# EAGLE design controller (EAGLE 6.4)
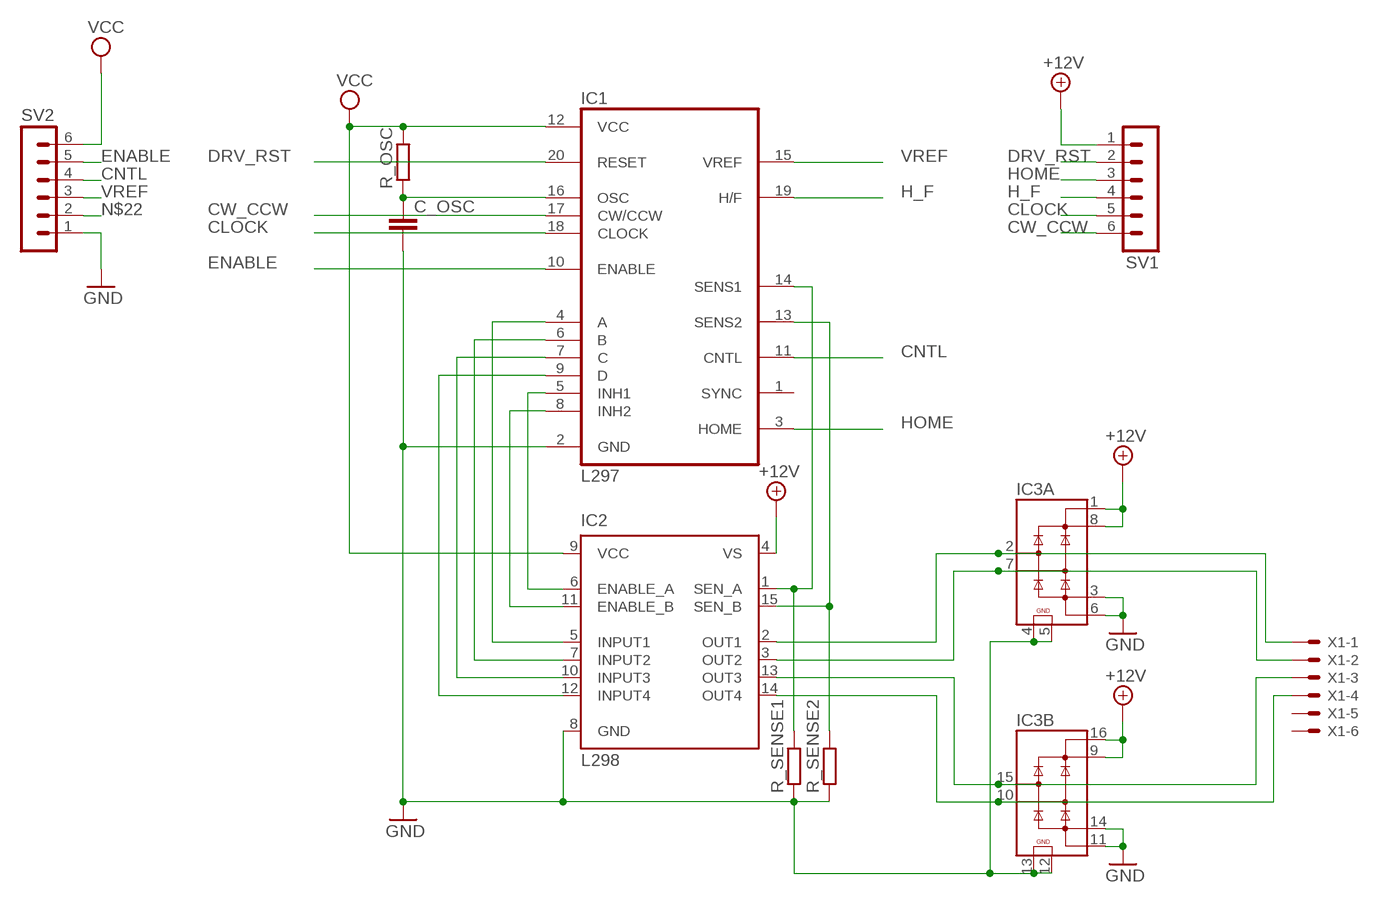
[diagram p0: schematic, sheet 1]

## Parts
C_OSC  C-EU025-030X050  [C025-030X050]
IC1  L297  [DIL20]
IC2  L298  [MULTIWATT-15]
IC3  L6210_2  [DIL16]
R_OSC  R-EU_0204/7  [0204/7]
R_SENSE1  R-EU_0204/7  [0204/7]
R_SENSE2  R-EU_0204/7  [0204/7]
SV1  MA06-1  [MA06-1]
SV2  MA06-1  [MA06-1]
X1  22-23-2061  [22-23-2061]

## Nets
+12V: IC2.4(VS) IC3.1(A:DC1+) IC3.8(A:DC2+) IC3.9(B:DC2+) IC3.16(B:DC1+) SV1.1
CLOCK: IC1.18(CLOCK) SV1.5
CNTL: IC1.11(CNTL) SV2.4
CW_CCW: IC1.17(CW/CCW) SV1.6
DRV_RST: IC1.20(RESET) SV1.2
ENABLE: IC1.10(ENABLE) SV2.5
GND: C_OSC.2 IC1.2(GND) IC2.8(GND) IC3.3(A:DC1-) IC3.4(A:GND1) IC3.5(A:GND2) IC3.6(A:DC2-) IC3.11(B:DC2-) IC3.12(B:GND2) IC3.13(B:GND1) IC3.14(B:DC1-) R_SENSE1.1 R_SENSE2.1 SV2.1
H_F: IC1.19(H/F) SV1.4
HOME: IC1.3(HOME) SV1.3
N$1: IC1.4(A) IC2.5(INPUT1)
N$2: IC1.6(B) IC2.7(INPUT2)
N$3: IC1.7(C) IC2.10(INPUT3)
N$4: IC1.9(D) IC2.12(INPUT4)
N$5: IC1.5(INH1) IC2.6(ENABLE_A)
N$6: IC1.8(INH2) IC2.11(ENABLE_B)
N$7: IC1.14(SENS1) IC2.1(SEN_A) R_SENSE1.2
N$8: IC1.13(SENS2) IC2.15(SEN_B) R_SENSE2.2
N$9: IC2.2(OUT1) IC3.2(A:AC1) X1.1
N$10: IC2.3(OUT2) IC3.7(A:AC2) X1.2
N$11: IC2.14(OUT4) IC3.10(B:AC2) X1.4
N$12: IC2.13(OUT3) IC3.15(B:AC1) X1.3
N$13: C_OSC.1 IC1.16(OSC) R_OSC.1
N$22: SV2.2
VCC: IC1.12(VCC) IC2.9(VCC) R_OSC.2 SV2.6
VREF: IC1.15(VREF) SV2.3
Unconnected: IC1.1(SYNC) X1.5 X1.6

## Library data of the parts
C_OSC = resistor:C-EU: CAPACITOR, European symbol
IC1 = st-microelectronics:L297: STEPPER MOTOR CONTROLLER; MPN: L297/1; OC_FARNELL: 1094209; OC_NEWARK: 56P8258
IC2 = st-microelectronics:L298: DUAL FULL-BRIDGE DRIVER; MPN: L298N; OC_FARNELL: 1589425; OC_NEWARK: 32M1527
IC3 = L6210:L6210_2: L6210 DUAL SCHOTTKY DIODE BRIDGE SGS-THOMSON
R_OSC R_SENSE1 R_SENSE2 = resistor:R-EU_: RESISTOR, European symbol
SV1 SV2 = con-lstb:MA06-1: PIN HEADER; OC_FARNELL: unknown; OC_NEWARK: unknown
X1 = con-molex:22-23-2061: .100" (2.54mm) Center Header - 6 Pin; MF: MOLEX; MPN: 22-23-2061; OC_FARNELL: 1462922; OC_NEWARK: 27C1933

## Board
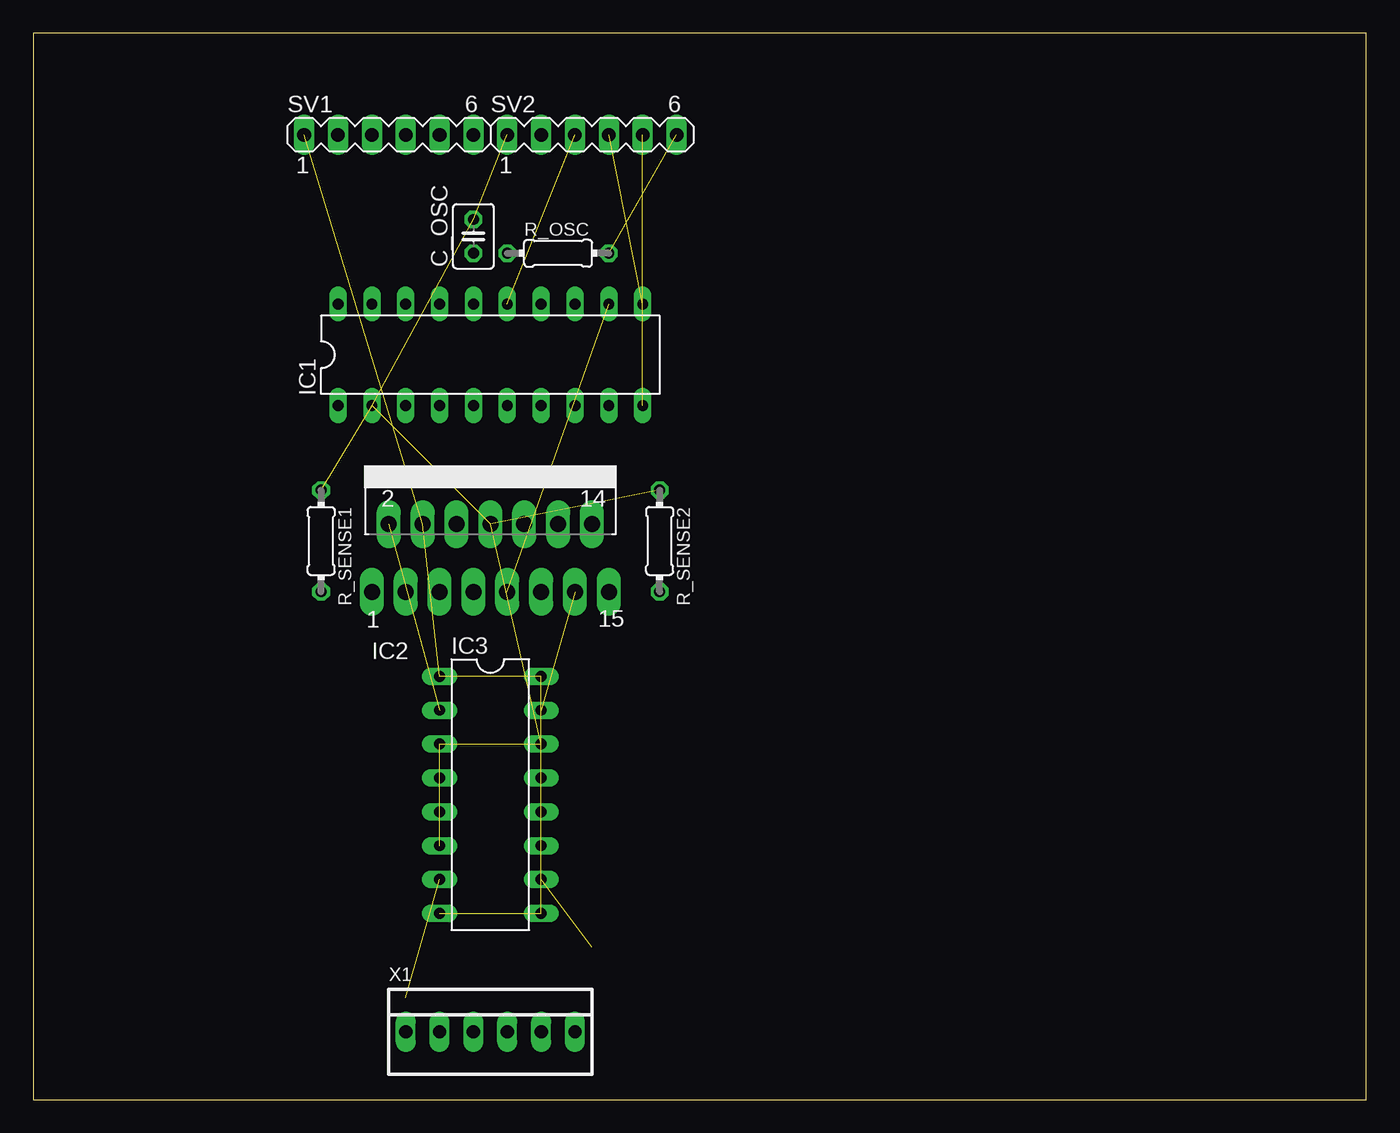
[diagram p1: board, top side]
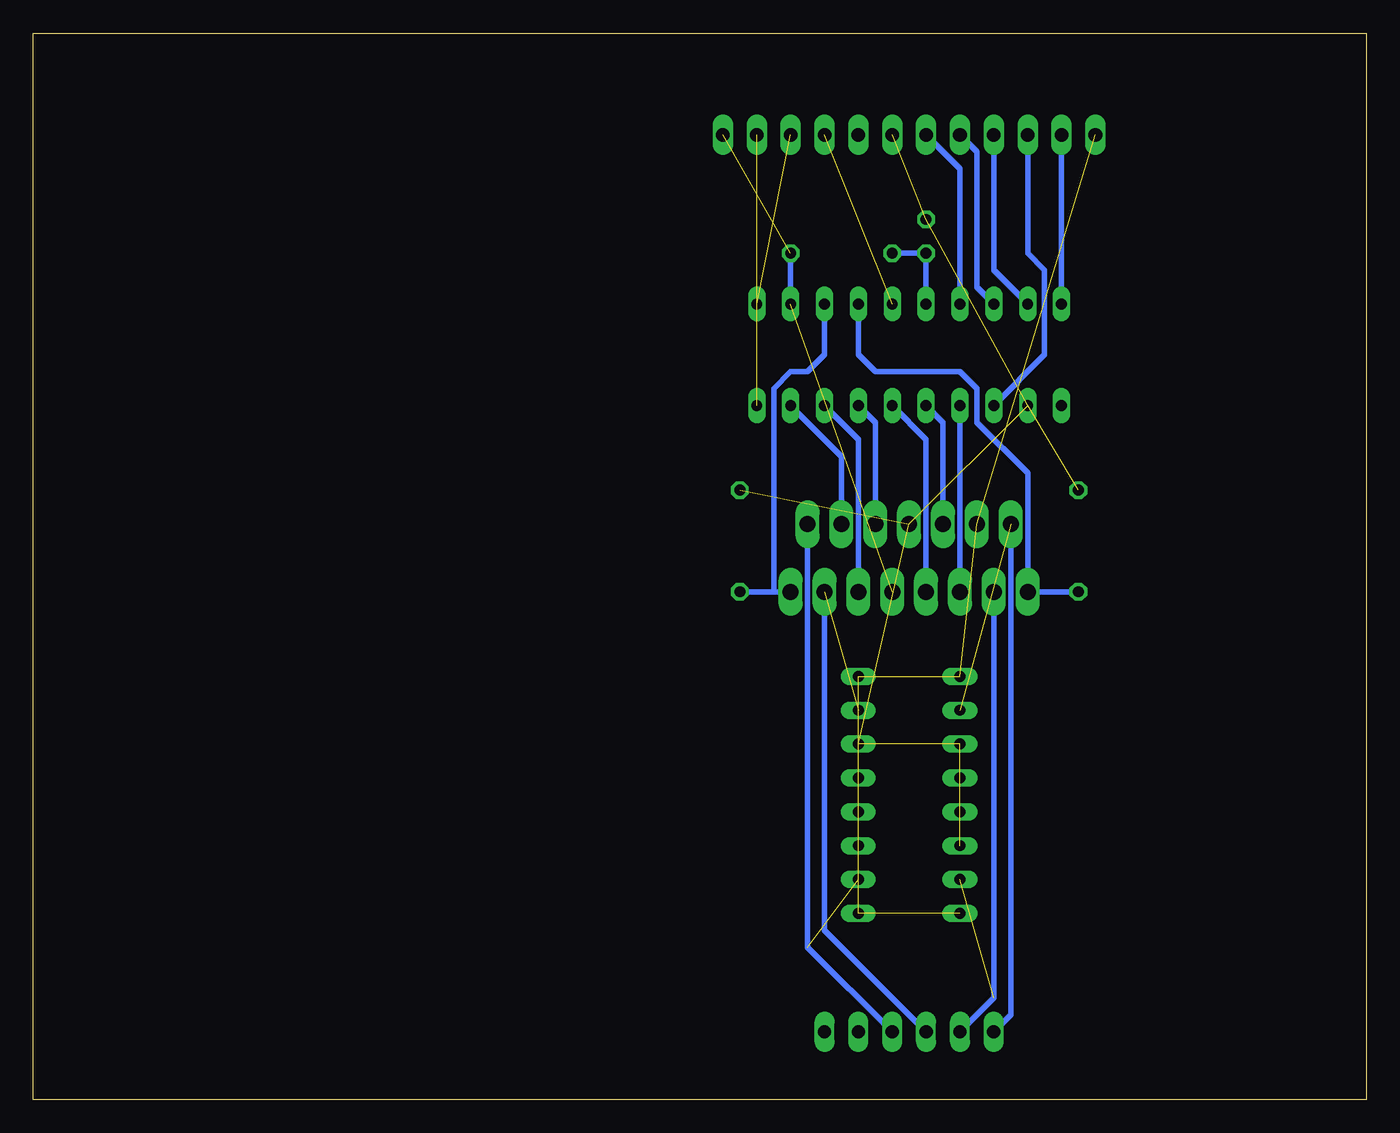
[diagram p2: board, bottom side, seen from below]

Size 100 x 80 mm. Coordinates in mm from the lower left corner, seen from the top.
Outline: 0,0 100,0 100,80 0,80 0,0
Copper layers (1*16): Top 0.035mm / dielectric 1.5mm / Bottom 0.035mm
Design rules "default": minimum track width 10mil, minimum drill 24mil, track to track 8mil, track to pad 8mil, pad to pad 8mil, via to via 8mil, smd to smd 8mil, copper to edge 40mil, drill to drill 8mil, minimum pad ring 10mil, minimum via ring 8mil, stop-mask expansion 4mil, vias tented up to drill 0mil, thermal gap 10mil

### Footprints (pad centres in the part's own frame; a part is rotated, then mirrored left to right if it is on the bottom)
C025-030X050 = drill 0.813 octagon: 1 -1.27,0; 2 1.27,0
DIL20 = drill 0.813 long: 1 -11.43,-3.81; 2 -8.89,-3.81; 3 -6.35,-3.81; 4 -3.81,-3.81; 5 -1.27,-3.81; 6 1.27,-3.81; 7 3.81,-3.81; 8 6.35,-3.81; 9 8.89,-3.81; 10 11.43,-3.81; 11 11.43,3.81; 12 8.89,3.81; 13 6.35,3.81; 14 3.81,3.81; 15 1.27,3.81; 16 -1.27,3.81; 17 -3.81,3.81; 18 -6.35,3.81; 19 -8.89,3.81; 20 -11.43,3.81
MULTIWATT-15 = drill 1.2 long: 1 -8.89,-7.62; 2 -7.62,-2.54; 3 -6.35,-7.62; 4 -5.08,-2.54; 5 -3.81,-7.62; 6 -2.54,-2.54; 7 -1.27,-7.62; 8 0,-2.54; 9 1.27,-7.62; 10 2.54,-2.54; 11 3.81,-7.62; 12 5.08,-2.54; 13 6.35,-7.62; 14 7.62,-2.54; 15 8.89,-7.62
DIL16 = drill 0.813 long: 1 -8.89,-3.81; 2 -6.35,-3.81; 3 -3.81,-3.81; 4 -1.27,-3.81; 5 1.27,-3.81; 6 3.81,-3.81; 7 6.35,-3.81; 8 8.89,-3.81; 9 8.89,3.81; 10 6.35,3.81; 11 3.81,3.81; 12 1.27,3.81; 13 -1.27,3.81; 14 -3.81,3.81; 15 -6.35,3.81; 16 -8.89,3.81
0204/7 = drill 0.813 octagon: 1 -3.81,0; 2 3.81,0
MA06-1 = drill 1.016 long: 1 -6.35,0; 2 -3.81,0; 3 -1.27,0; 4 1.27,0; 5 3.81,0; 6 6.35,0
22-23-2061 = drill 1 long: 1 -6.35,0; 2 -3.81,0; 3 -1.27,0; 4 1.27,0; 5 3.81,0; 6 6.35,0

### Placement (x,y rotation side)
C_OSC  33.02,64.77 90 top
IC1  34.29,55.88 0 top
IC2  34.29,45.72 0 top
IC3  34.29,22.86 270 top
R_OSC  39.37,63.5 0 top
R_SENSE1  21.59,41.91 270 top
R_SENSE2  46.99,41.91 270 top
SV1  26.67,72.39 0 top
SV2  41.91,72.39 0 top
X1  34.29,5.08 0 top

### Tracks (layer width: path | path; a pad name or v marks a point on that pad's centre or on a via)
+12V  (5 unrouted)
CLOCK
  Bottom 0.406: IC1.18 29.21,60.96 29.21,71.12 SV1.5
CNTL  (1 unrouted)
CW_CCW
  Bottom 0.406: IC1.17 30.48,69.85 SV1.6
DRV_RST
  Bottom 0.406: SV1.2 IC1.20
ENABLE  (1 unrouted)
GND  (13 unrouted)
H_F
  Bottom 0.406: IC1.19 27.94,62.23 SV1.4
HOME
  Bottom 0.406: IC1.3 24.13,55.88 24.13,62.23 25.4,63.5 SV1.3
N$1
  Bottom 0.406: IC1.4 IC2.5
N$2
  Bottom 0.406: IC1.6 33.02,49.53 IC2.7
N$3
  Bottom 0.406: IC1.7 36.83,50.8 IC2.10
N$4
  Bottom 0.406: IC1.9 39.37,48.26 IC2.12
N$5
  Bottom 0.406: IC1.5 31.75,50.8 IC2.6
N$6
  Bottom 0.406: IC1.8 38.1,49.53 IC2.11
N$7
  Bottom 0.406: R_SENSE1.2 IC2.1 25.4,46.99 29.21,50.8 29.21,53.34 30.48,54.61 36.83,54.61 38.1,55.88 IC1.14
N$8
  Bottom 0.406: R_SENSE2.2 44.45,38.1 | 44.45,38.1 IC2.15 | IC1.13 40.64,55.88 41.91,54.61 43.18,54.61 44.45,53.34 44.45,38.1
N$9  (1 unrouted)
  Bottom 0.406: IC2.2 26.67,6.35 X1.1
N$10  (1 unrouted)
  Bottom 0.406: IC2.3 27.94,7.62 X1.2
N$11  (1 unrouted)
  Bottom 0.406: IC2.14 41.91,11.43 X1.4
N$12  (1 unrouted)
  Bottom 0.406: IC2.13 40.64,12.7 X1.3
N$13
  Bottom 0.406: R_OSC.1 C_OSC.1 IC1.16
VCC  (2 unrouted)
  Bottom 0.406: R_OSC.2 IC1.12
VREF  (1 unrouted)